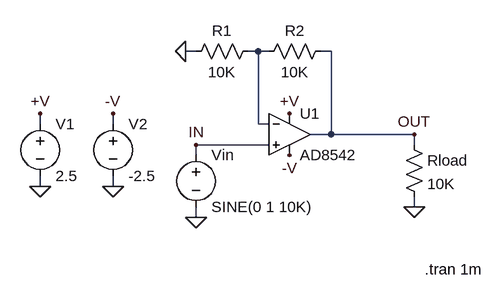
[diagram p0: schematic AD8542.asc]
AD8542.asc, the LTspice schematic file:
Version 4
SHEET 1 1240 700
WIRE 576 -1152 560 -1152
WIRE 672 -1152 656 -1152
WIRE 688 -1152 672 -1152
WIRE 784 -1152 768 -1152
WIRE 336 -1040 336 -1056
WIRE 448 -1040 448 -1056
WIRE 672 -1040 672 -1152
WIRE 688 -1040 672 -1040
WIRE 784 -1024 784 -1152
WIRE 784 -1024 752 -1024
WIRE 912 -1024 784 -1024
WIRE 688 -1008 576 -1008
WIRE 912 -1008 912 -1024
WIRE 576 -992 576 -1008
WIRE 336 -944 336 -960
WIRE 448 -944 448 -960
WIRE 912 -912 912 -928
WIRE 576 -896 576 -912
FLAG 336 -1056 +V
FLAG 336 -944 0
FLAG 576 -896 0
FLAG 912 -1024 OUT
FLAG 576 -1008 IN
FLAG 720 -1056 +V
FLAG 448 -1056 -V
FLAG 720 -992 -V
FLAG 560 -1152 0
FLAG 912 -912 0
FLAG 448 -944 0
SYMBOL Opamps\\AD8542 720 -1088 R0
SYMATTR InstName U1
SYMBOL voltage 336 -1056 R0
WINDOW 123 0 0 Left 2
WINDOW 39 0 0 Left 2
SYMATTR InstName V1
SYMATTR Value 2.5
SYMBOL voltage 576 -1008 R0
WINDOW 123 24 146 Left 2
WINDOW 39 24 125 Left 2
SYMATTR InstName Vin
SYMATTR Value SINE(0 1 10K)
SYMBOL res 672 -1168 R90
WINDOW 0 0 56 VBottom 2
WINDOW 3 32 56 VTop 2
SYMATTR InstName R1
SYMATTR Value 10K
SYMBOL res 784 -1168 R90
WINDOW 0 0 56 VBottom 2
WINDOW 3 32 56 VTop 2
SYMATTR InstName R2
SYMATTR Value 10K
SYMBOL voltage 448 -1056 R0
WINDOW 123 24 146 Left 2
WINDOW 39 24 125 Left 2
SYMATTR InstName V2
SYMATTR Value -2.5
SYMBOL res 896 -1024 R0
SYMATTR InstName Rload
SYMATTR Value 10K
TEXT 928 -816 Left 2 !.tran 1m

The netlist it stands for:
* AD8542.asc
XU1 IN N001 +V -V OUT AD8542  ; pins In+ In- V+ V- OUT
V1 +V 0 2.5
Vin IN 0 SINE(0 1 10K)
R1 N001 0 10K
R2 OUT N001 10K
V2 -V 0 -2.5
Rload OUT 0 10K
.tran 1m
.lib AD8542.sub
.backanno
.end